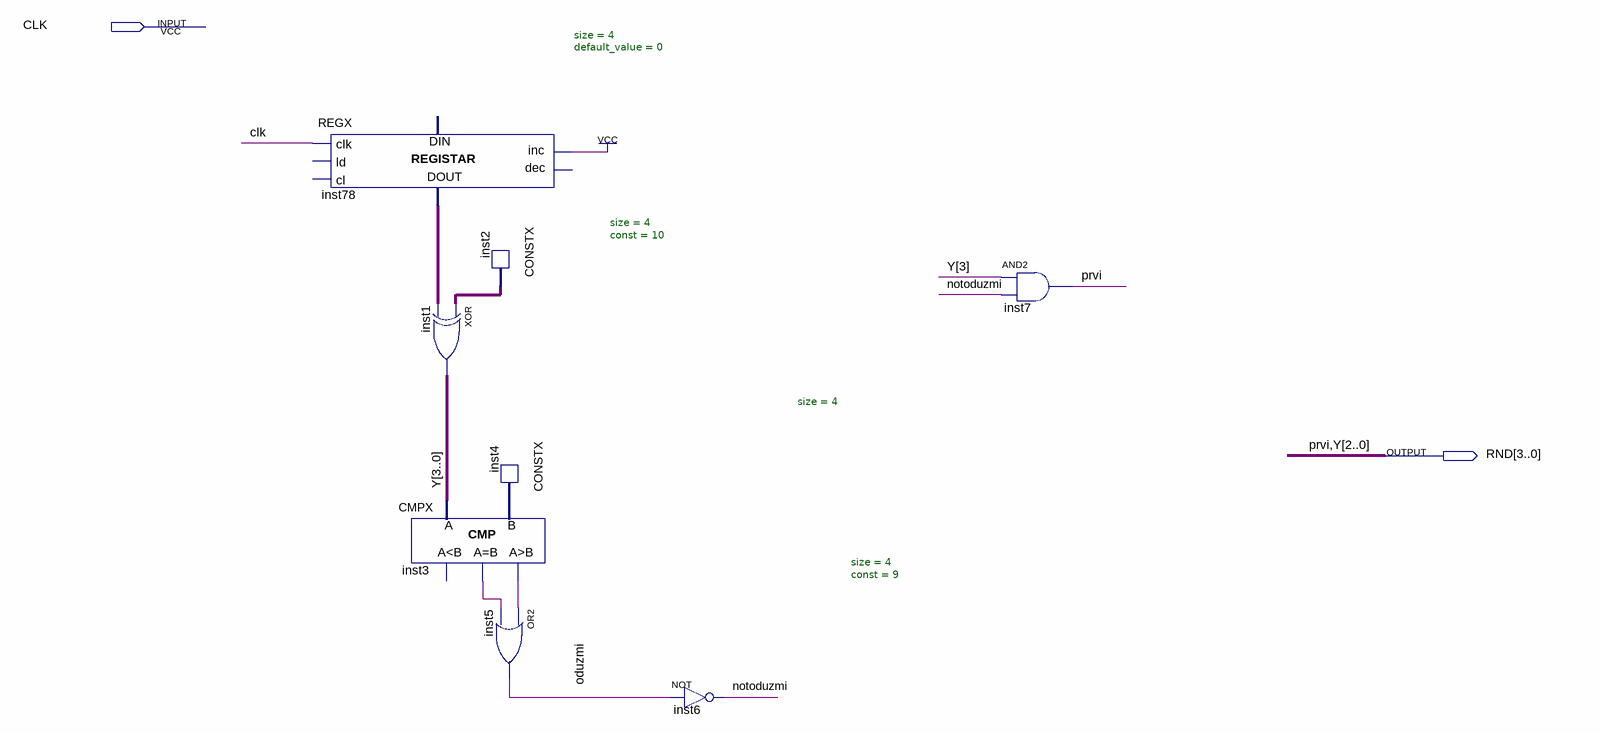
[diagram p0: schematic sheet]
// Quartus schematic Random.bdf as structural Verilog: 8 symbols, 2 pins
module Random (
  input  CLK,
  output [3:0] RND
);

  wire inst3_eq, inst3_gr, notoduzmi, oduzmi;
  wire [3:0] inst2_data, inst4_data, inst78_data_out;
  wire [3:3] Y;

  REGX #(.size(4), .default_value(0)) inst78 (
    .clk(CLK), .inc(1'b1), .data_out(inst78_data_out));  // open: ld, cl, dec, data_in
  CMPX #(.size(4)) inst3 (.A({Y[3], RND[2:0]}), .B(inst4_data), .eq(inst3_eq), .gr(inst3_gr));  // open: ls
  CONSTX #(.size(4), .\const (10)) inst2 (.data(inst2_data));
  assign {Y[3], RND[2:0]} = inst2_data ^ inst78_data_out;  // XOR inst1, 4 bits wide
  CONSTX #(.size(4), .\const (9)) inst4 (.data(inst4_data));
  or inst5 (oduzmi, inst3_gr, inst3_eq);
  not inst6 (notoduzmi, oduzmi);
  and inst7 (RND[3], Y[3], notoduzmi);

  // Other names for the same wires on the sheet: prvi = RND[3]; Y[2:0] = RND[2:0]
endmodule
